# Altium schematic sheet Schematic_Block.SchDoc
size A4; SheetNumber: 1; SheetTotal: 11
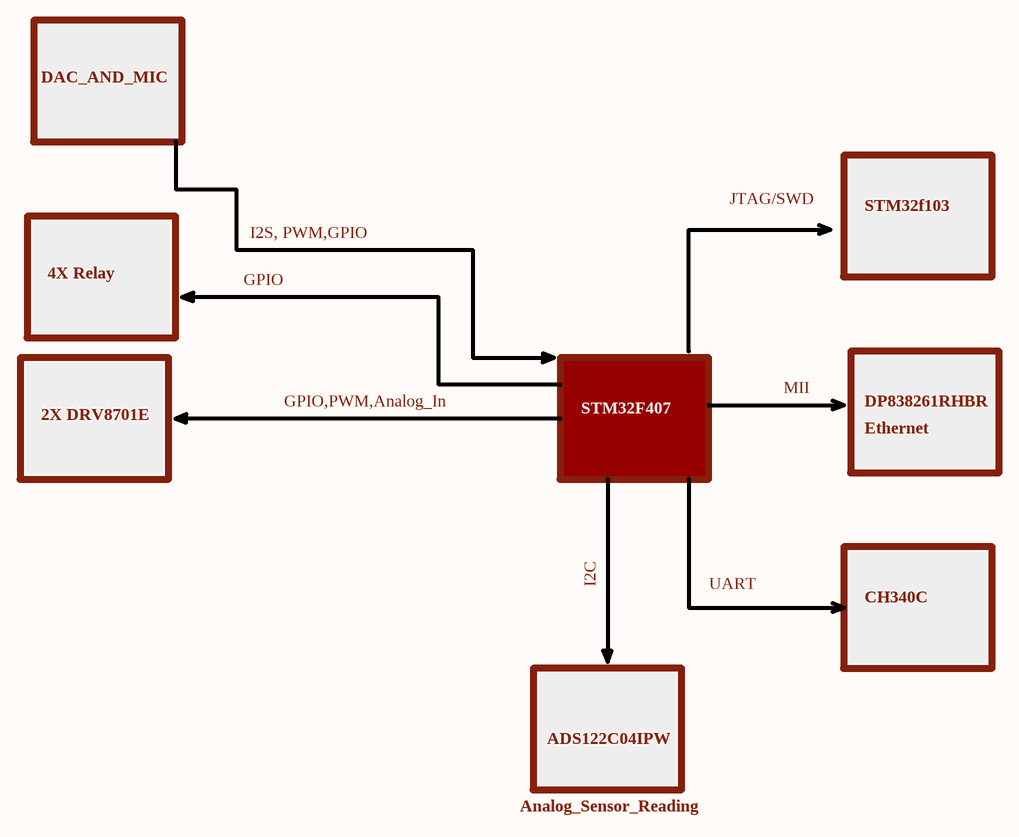
[diagram p0: Schematic_Block.SchDoc]

## Notes on the sheet
- DAC_AND_MIC
- JTAG/SWD
- STM32f103
- 4X Relay
- GPIO
- I2S, PWM,GPIO
- 2X DRV8701E
- GPIO,PWM,Analog_In
- STM32F407
- MII
- DP838261RHBR
- Ethernet
- I2C
- UART
- CH340C
- ADS122C04IPW
- Analog_Sensor_Reading